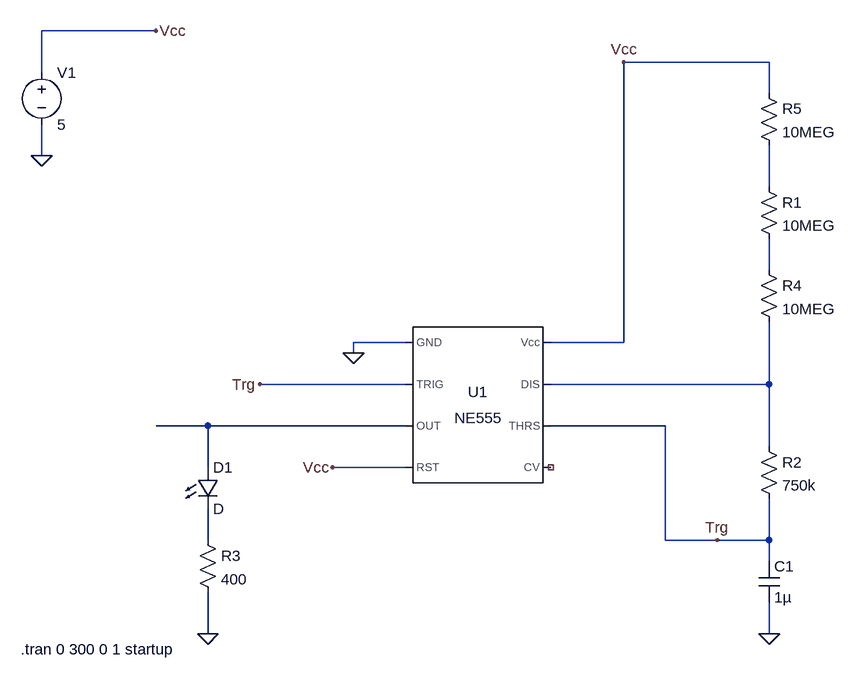
[diagram p0: schematic NE555Blink.asc]
NE555Blink.asc, the LTspice schematic file:
Version 4
SHEET 1 880 680
WIRE -288 -368 -464 -368
WIRE 656 -320 432 -320
WIRE -464 -304 -464 -368
WIRE 656 -272 656 -320
WIRE -464 -176 -464 -224
WIRE 656 -128 656 -192
WIRE 656 0 656 -48
WIRE 96 112 16 112
WIRE 432 112 432 -320
WIRE 432 112 320 112
WIRE 16 128 16 112
WIRE 96 176 -128 176
WIRE 656 176 656 80
WIRE 656 176 320 176
WIRE -208 240 -288 240
WIRE 96 240 -208 240
WIRE 496 240 320 240
WIRE 656 272 656 176
WIRE -208 304 -208 240
WIRE 96 304 -16 304
WIRE -208 416 -208 368
WIRE 496 416 496 240
WIRE 576 416 496 416
WIRE 656 416 656 352
WIRE 656 416 576 416
WIRE 656 448 656 416
WIRE -208 560 -208 496
WIRE 656 560 656 512
FLAG 16 128 0
FLAG 656 560 0
FLAG 432 -320 Vcc
FLAG -464 -176 0
FLAG -288 -368 Vcc
FLAG -208 560 0
FLAG -16 304 Vcc
FLAG -128 176 Trg
FLAG 576 416 Trg
SYMBOL Misc\\NE555 208 208 R0
SYMATTR InstName U1
SYMBOL res 640 -144 R0
SYMATTR InstName R1
SYMATTR Value 10MEG
SYMATTR SpiceLine tol=1% pwr=0.125
SYMBOL res 640 256 R0
SYMATTR InstName R2
SYMATTR Value 750k
SYMATTR SpiceLine tol=1% pwr=0.125
SYMBOL cap 640 448 R0
SYMATTR InstName C1
SYMATTR Value 1µ
SYMBOL LED -224 304 R0
SYMATTR InstName D1
SYMBOL res -224 400 R0
SYMATTR InstName R3
SYMATTR Value 400
SYMATTR SpiceLine tol=1% pwr=0.125
SYMBOL voltage -464 -320 R0
WINDOW 123 0 0 Left 2
WINDOW 39 0 0 Left 2
SYMATTR InstName V1
SYMATTR Value 5
SYMBOL res 640 -16 R0
SYMATTR InstName R4
SYMATTR Value 10MEG
SYMATTR SpiceLine tol=1% pwr=0.125
SYMBOL res 640 -288 R0
SYMATTR InstName R5
SYMATTR Value 10MEG
SYMATTR SpiceLine tol=1% pwr=0.125
TEXT -496 584 Left 2 !.tran 0 300 0 1 startup

The netlist it stands for:
* NE555Blink.asc
XU1 0 Trg N004 Vcc NC_01 Trg N003 Vcc NE555  ; pins GND TRIG OUT RST CV THRS DIS Vcc
R1 N001 N002 10MEG tol=1% pwr=0.125
R2 N003 Trg 750k tol=1% pwr=0.125
C1 Trg 0 1µ
D1 N004 N005 D
R3 N005 0 400 tol=1% pwr=0.125
V1 Vcc 0 5
R4 N002 N003 10MEG tol=1% pwr=0.125
R5 Vcc N001 10MEG tol=1% pwr=0.125
.model D D
.lib standard.dio
.tran 0 300 0 1 startup
.lib NE555.sub
.backanno
.end

* Results of the author's LTspice run, read from the files saved beside the schematic
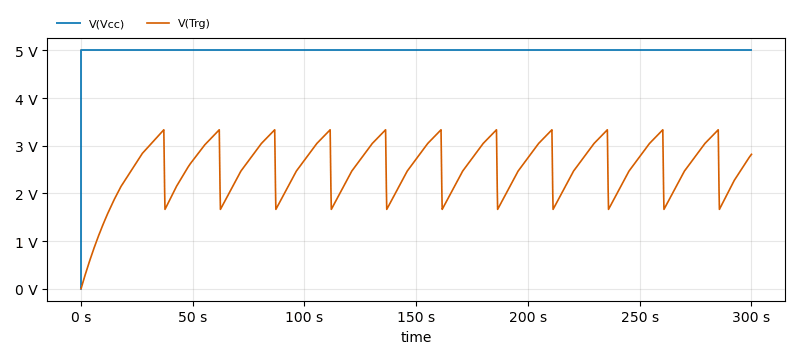
[diagram p1: Transient Analysis of NE555Blink.asc, plotted from the saved traces]
* Transient Analysis, 1 run:
*   V(Vcc): min 0 V, max 5 V, average 5 V, rms 5 V, last 5 V
*   V(Trg): min 0 V, max 3.334 V, average 2.513 V, rms 2.592 V, last 2.82 V